# EAGLE design RaspberryPi-PICPgm-BC338 (EAGLE 7.2.0)
PIC Programmer using Raspberry Pi GPIOs http://holdenc.altervista.org/rpp/ http://holdenc.altervista.org/rpp/downloads/rpp010.tgz http://www.techmeology.co.uk/rpipic/rpipic-2012100701.tar.gz http://mujweb.cz/tlc/rpp/ https://github.com/oh7bf/PiPIC/tree/master/RaspiPICprog http://www.techmeology.co.uk/rpipic/
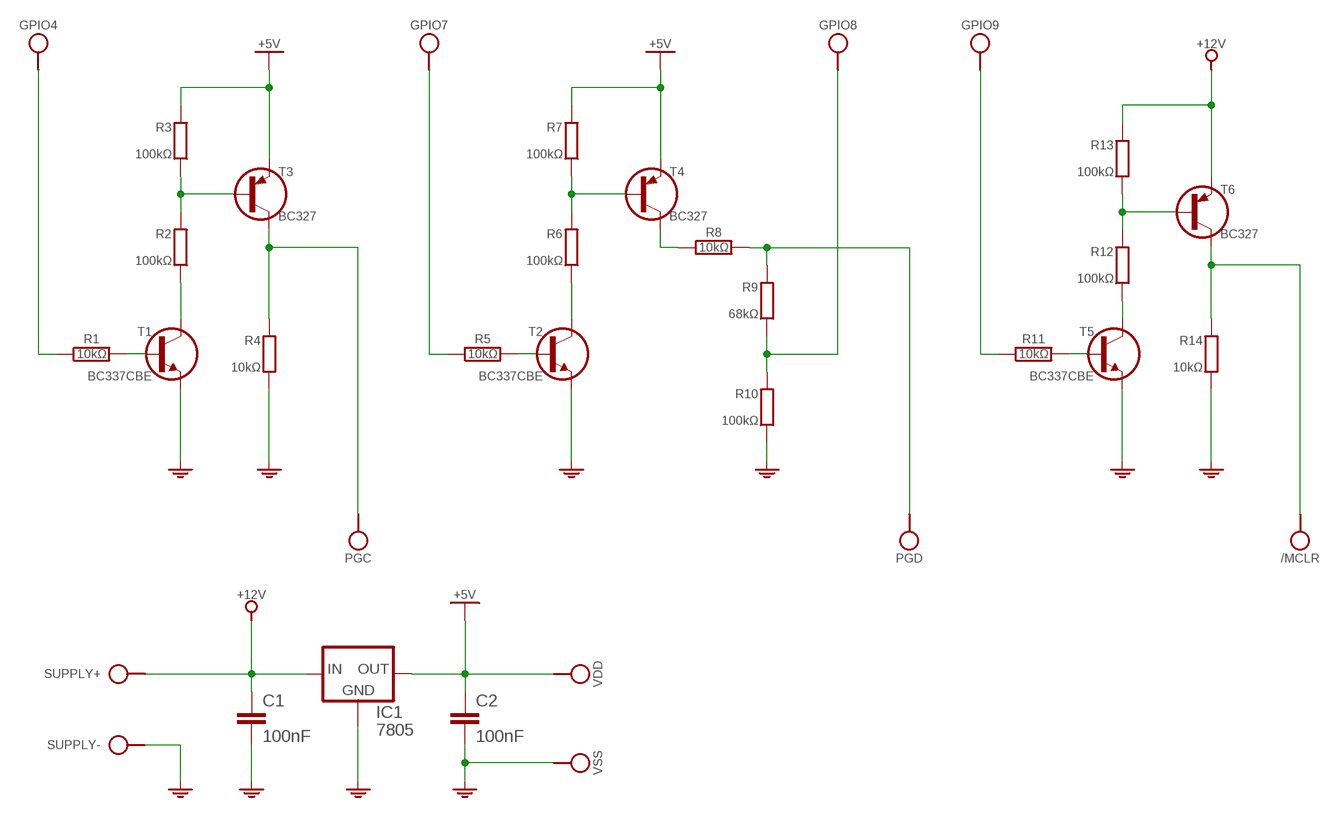
[diagram p0: schematic, sheet 1]

## Parts
/MCLR  VPORT  [SPAD]
C1  100nF  C050-025X075  [C050-025X075]
C2  100nF  C050-025X075  [C050-025X075]
GPIO4  VPORT  [SPAD]
GPIO7  VPORT  [SPAD]
GPIO8  VPORT  [SPAD]
GPIO9  VPORT  [SPAD]
IC1  7805  LM78  [TO220]
PGC  VPORT  [SPAD]
PGD  VPORT  [SPAD]
R1  10kΩ  R-H0204/10  [0204/10]
R2  100kΩ  R0204/12-V  [0204/12-V]
R3  100kΩ  R0204/12-V  [0204/12-V]
R4  10kΩ  R0204/12-V  [0204/12-V]
R5  10kΩ  R-H0204/10  [0204/10]
R6  100kΩ  R0204/12-V  [0204/12-V]
R7  100kΩ  R0204/12-V  [0204/12-V]
R8  10kΩ  R-H0204/10  [0204/10]
R9  68kΩ  R0204/12-V  [0204/12-V]
R10  100kΩ  R0204/12-V  [0204/12-V]
R11  10kΩ  R-H0204/10  [0204/10]
R12  100kΩ  R0204/12-V  [0204/12-V]
R13  100kΩ  R0204/10-V  [0204/10-V]
R14  10kΩ  R0204/12-V  [0204/12-V]
SUPPLY  SPAD+--+  [SPAD-+]
T1  BC337CBE  [TO92-CBE]
T2  BC337CBE  [TO92-CBE]
T3  BC327  [TO92]
T4  BC327  [TO92]
T5  BC337CBE  [TO92-CBE]
T6  BC327  [TO92]
VDD  VPORT  [SPAD]
VSS  VPORT  [SPAD]

## Nets
+5V: C2.1 IC1.3(OUT) VDD.1
+12V: C1.1 IC1.1(IN) R3.1 R7.1 R13.1 SUPPLY.2 T3.3(E) T4.3(E) T6.3(E) ; supply symbol labelled +5V
GND: C1.2 C2.2 IC1.2(GND) R4.2 R10.2 R14.2 SUPPLY.1 T1.E T2.E T5.E VSS.1
N$1: GPIO4.1 R1.1
N$2: R1.2 T1.B
N$3: R2.2 T1.C
N$4: R2.1 R3.2 T3.2(B)
N$5: PGC.1 R4.1 T3.1(C)
N$6: GPIO7.1 R5.1
N$7: R5.2 T2.B
N$8: R6.2 T2.C
N$9: R6.1 R7.2 T4.2(B)
N$10: R8.1 T4.1(C)
N$11: PGD.1 R8.2 R9.1
N$12: GPIO8.1 R9.2 R10.1
N$13: GPIO9.1 R11.1
N$14: R11.2 T5.B
N$15: R12.2 T5.C
N$16: R12.1 R13.2 T6.2(B)
N$17: /MCLR.1 R14.1 T6.1(C)

## Library data of the parts
/MCLR GPIO4 GPIO7-GPIO9 PGC PGD VDD VSS = pad:VPORT
C1 C2 = c:C: CAPACITOR, European symbol
IC1 = ic:LM78*
R1 R5 R8 R11 = r:R-H
R2-R4 R6 R7 R9 R10 R12-R14 = r:R: RESISTOR, European symbol
SUPPLY = pad:SPAD+-
T1 T2 T5 = t:BC337
T3 T4 T6 = t:BC327

## Board
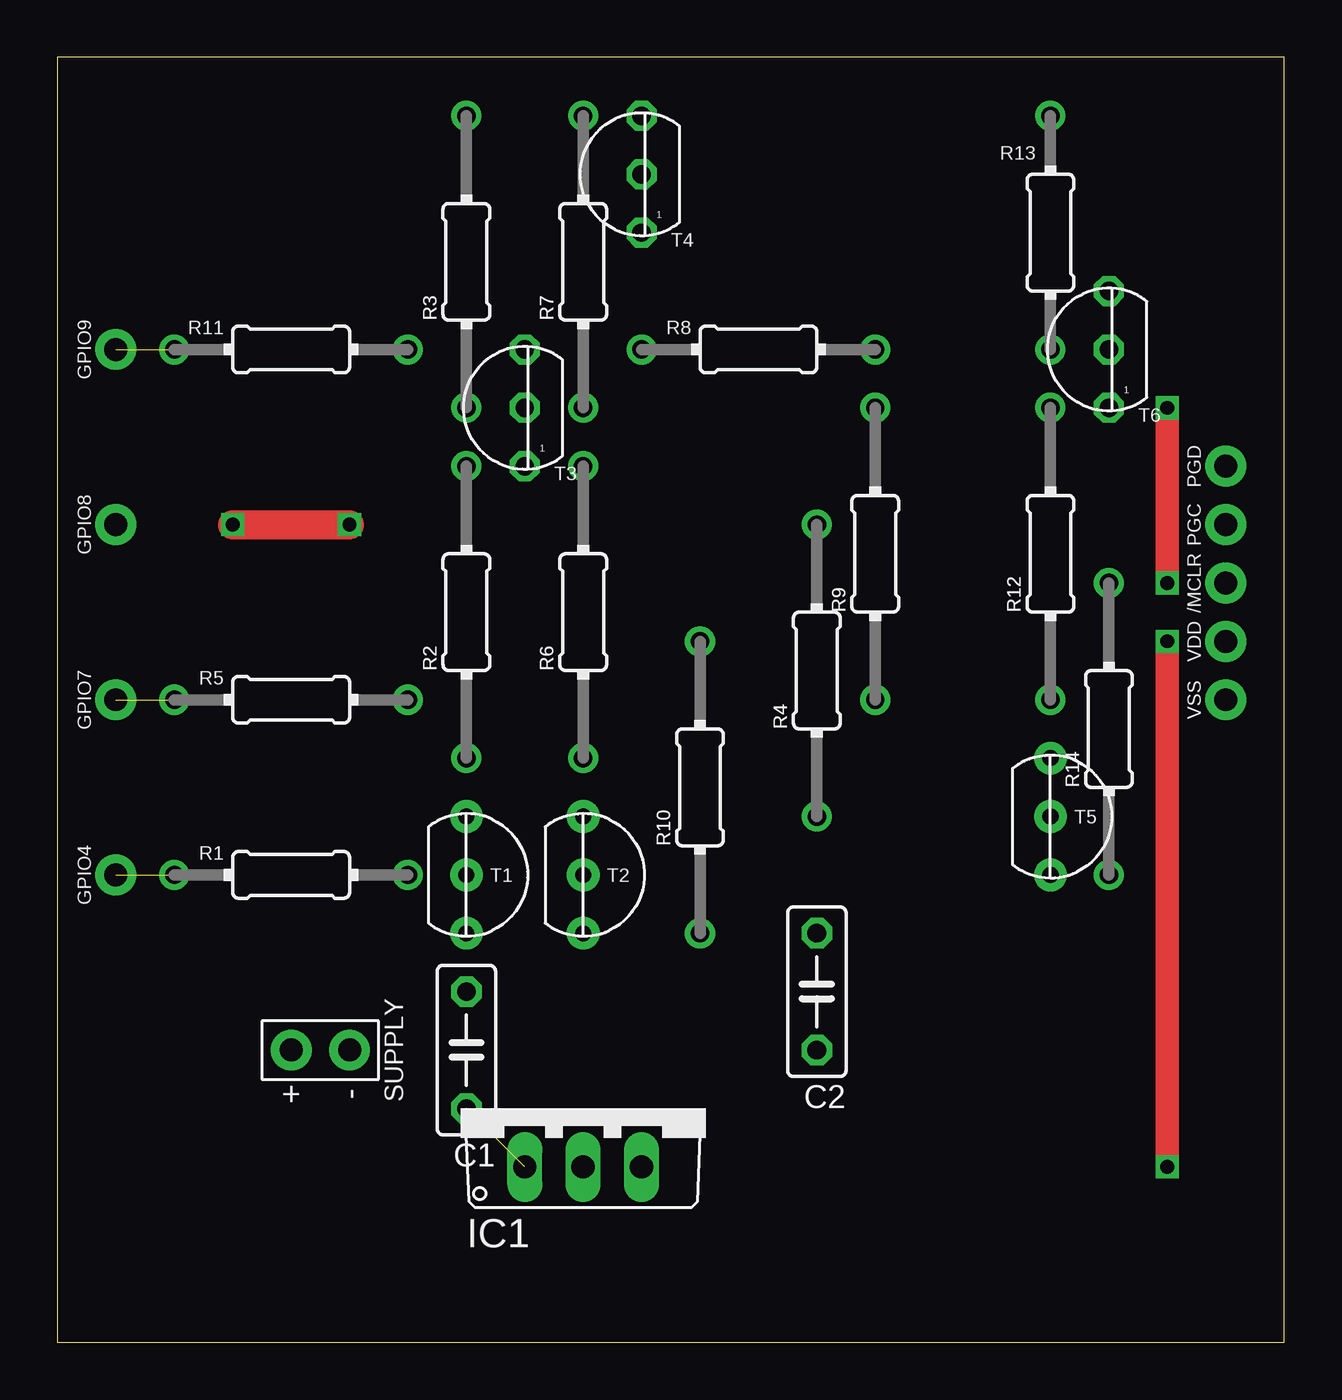
[diagram p1: board, top side]
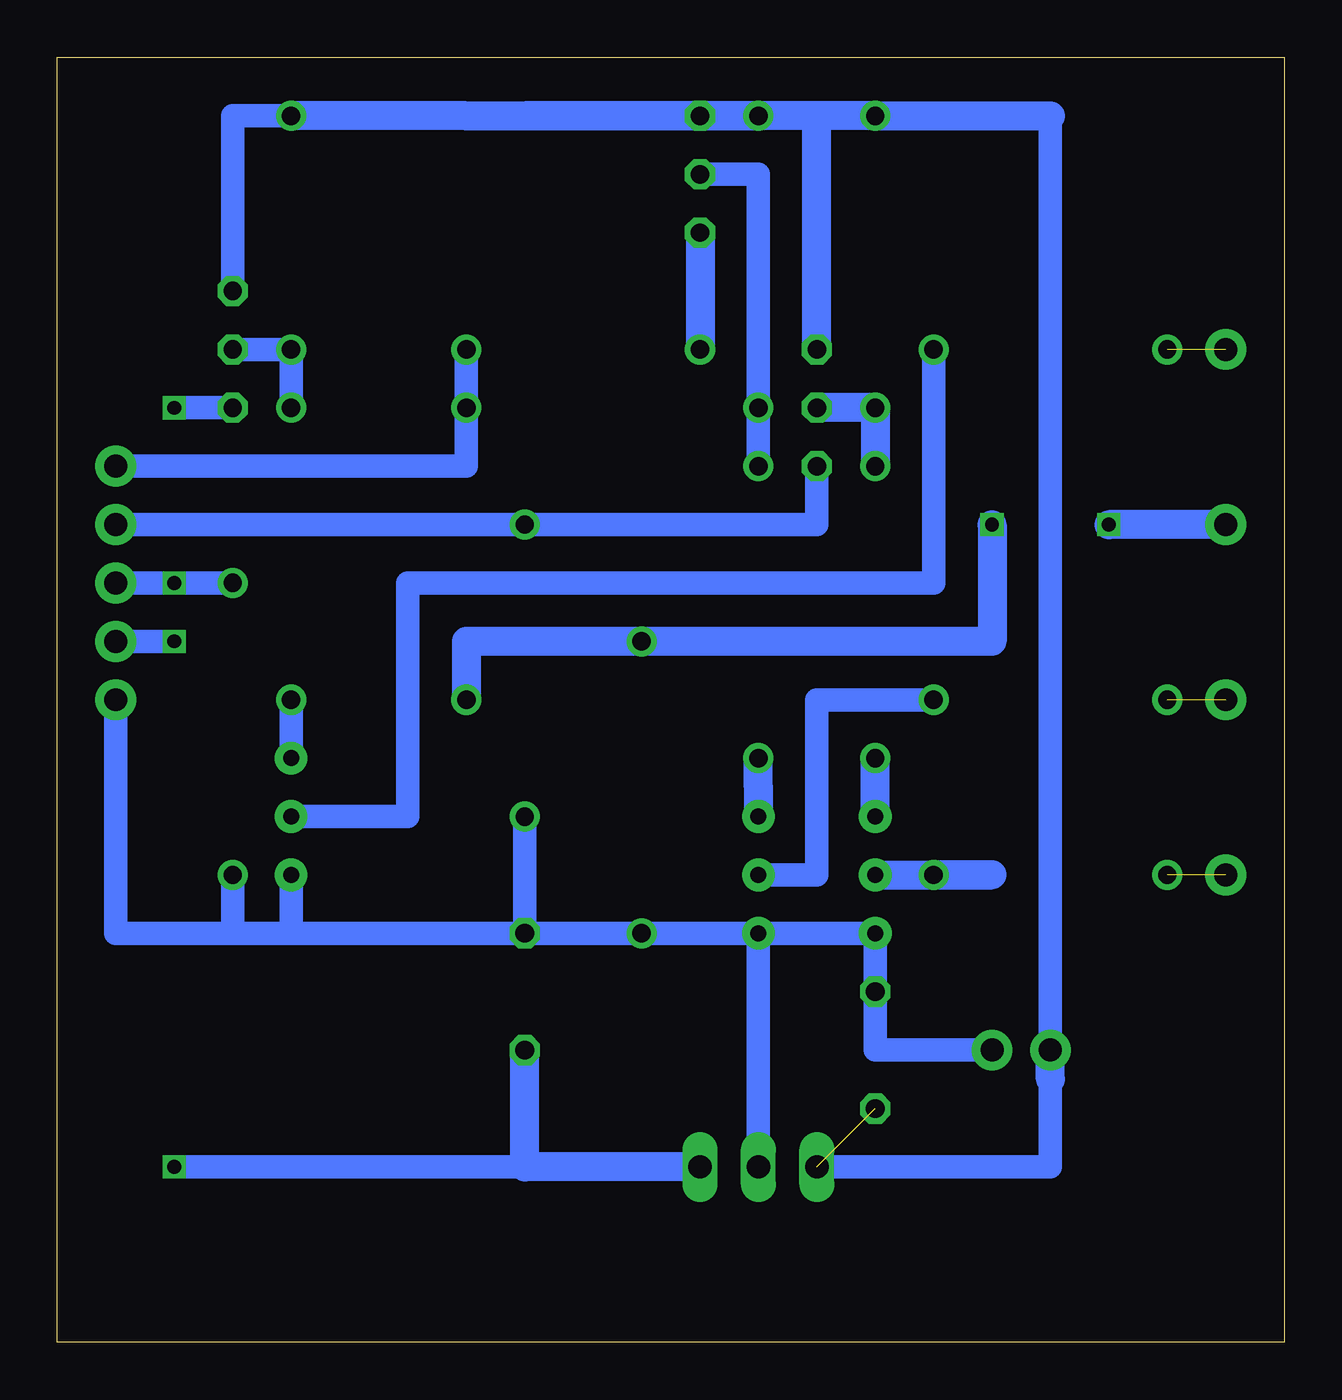
[diagram p2: board, bottom side, seen from below]

Size 53.34 x 55.88 mm. Coordinates in mm from the lower left corner, seen from the top.
Outline: 0,0 53.34,0 53.34,55.88 0,55.88 0,0
Copper layers (1*16): Top 0.035mm / dielectric 1.5mm / Bottom 0.035mm
Design rules "default": minimum track width 10mil, minimum drill 24mil, track to track 8mil, track to pad 8mil, pad to pad 8mil, via to via 8mil, smd to smd 8mil, copper to edge 40mil, drill to drill 8mil, minimum pad ring 10mil, minimum via ring 8mil, stop-mask expansion 4mil, vias tented up to drill 0mil, thermal gap 10mil

### Footprints (pad centres in the part's own frame; a part is rotated, then mirrored left to right if it is on the bottom)
SPAD = drill 1 pad 1.778: 1 0,0
C050-025X075 = drill 0.813 octagon: 1 2.54,0; 2 -2.54,0
TO220 = drill 1.016 long: 1 -2.54,-2.54; 2 0,-2.54; 3 2.54,-2.54
0204/10 = drill 0.8: 1 -5.08,0; 2 5.08,0
0204/12-V = drill 0.8: 1 0,6.35; 2 0,-6.35
0204/10-V = drill 0.8: 1 0,5.08; 2 0,-5.08
SPAD-+ = drill 1 pad 1.778: 1 0,-1.27; 2 0,1.27
TO92-CBE = drill 0.7 pad 1.422: B 0,0; C 0,2.54; E 0,-2.54
TO92 = drill 0.8 octagon: 1 0,2.54; 2 0,0; 3 0,-2.54

### Placement (x,y rotation side)
/MCLR  50.8,33.02 0 top
C1  17.78,12.7 270 top
C2  33.02,15.24 270 top
GPIO4  2.54,20.32 0 top
GPIO7  2.54,27.94 0 top
GPIO8  2.54,35.56 0 top
GPIO9  2.54,43.18 0 top
IC1  22.86,10.16 0 top
PGC  50.8,35.56 0 top
PGD  50.8,38.1 0 top
R1  10.16,20.32 0 top
R2  17.78,31.75 0 top
R3  17.78,46.99 0 top
R4  33.02,29.21 0 top
R5  10.16,27.94 0 top
R6  22.86,31.75 0 top
R7  22.86,46.99 0 top
R8  30.48,43.18 0 top
R9  35.56,34.29 0 top
R10  27.94,24.13 0 top
R11  10.16,43.18 0 top
R12  43.18,34.29 0 top
R13  43.18,48.26 0 top
R14  45.72,26.67 0 top
SUPPLY  11.43,12.7 90 top
T1  17.78,20.32 0 top
T2  22.86,20.32 0 top
T3  20.32,40.64 180 top
T4  25.4,50.8 180 top
T5  43.18,22.86 0 top
T6  45.72,43.18 180 top
VDD  50.8,30.48 0 top
VSS  50.8,27.94 0 top

### Tracks (layer width: path | path; a pad name or v marks a point on that pad's centre or on a via)
+5V  (via drill 0.6)
  Top 1.016: v48.26,7.62 v48.26,30.48
  Bottom 1.016: IC1.3 v48.26,7.62 | v48.26,30.48 VDD.1
  Bottom 1.27: IC1.3 33.02,7.62 C2.1
+12V  (1 unrouted)
  Bottom 1.016: T6.3 45.72,53.34 R13.1 | IC1.1 10.16,7.62 10.16,11.43 10.16,53.34
  Bottom 1.27: 20.32,53.34 R3.1 10.16,53.34 | 33.02,53.34 35.56,53.34 R13.1 | R7.1 33.02,53.34 | 33.02,53.34 T4.3 R7.1 | T3.3 20.32,53.34 | 10.16,11.43 SUPPLY.2 | 20.32,53.34 R7.1
GND
  Bottom 1.016: 45.72,17.78 R14.2 45.72,17.78 | 45.72,17.78 43.18,17.78 | 43.18,17.78 T5.E 43.18,17.78 | C2.2 43.18,17.78 | T2.E R10.2 C2.2 | SUPPLY.1 17.78,12.7 C1.2 T1.E T2.E | T2.E IC1.2 | R4.2 C2.2 | VSS.1 50.8,20.32 50.8,17.78 45.72,17.78
N$1  (1 unrouted)
N$2
  Bottom 1.27: T1.B 12.7,20.32 R1.2 | T1.B
N$3
  Bottom 1.27: T1.C | T1.C R2.2 | T1.C
N$4
  Bottom 1.27: T3.2 R3.2 R2.1
N$5
  Bottom 1.016: PGC.1 R4.1 20.32,35.56 T3.1
N$6  (1 unrouted)
N$7
  Bottom 1.016: T2.B 20.32,20.32 20.32,27.94 R5.2
N$8
  Bottom 1.27: R6.2 22.86,24.13 T2.C | R6.2
N$9
  Bottom 1.016: T4.2 22.86,50.8 R7.2 R6.1
N$10
  Bottom 1.27: T4.1 | T4.1 | T4.1 R8.1
N$11
  Bottom 1.016: R8.2 R9.1 35.56,38.1 PGD.1
N$12  (via drill 0.6)
  Top 1.27: v7.62,35.56 v12.7,35.56
  Bottom 1.27: GPIO8.1 v7.62,35.56 | v12.7,35.56 12.7,30.48 R10.1 35.56,30.48 R9.2
N$13  (1 unrouted)
N$14
  Bottom 1.016: R11.2 15.24,33.02 38.1,33.02 38.1,22.86 T5.B
N$15
  Bottom 1.016: R12.2 T5.C
N$16
  Bottom 1.016: R12.1 R13.2 T6.2
N$17  (via drill 0.6)
  Top 1.016: v48.26,33.02 v48.26,40.64
  Bottom 1.016: /MCLR.1 v48.26,33.02 R14.1 | v48.26,40.64 T6.1